# Altium schematic sheet Power supply.SchDoc
size A4
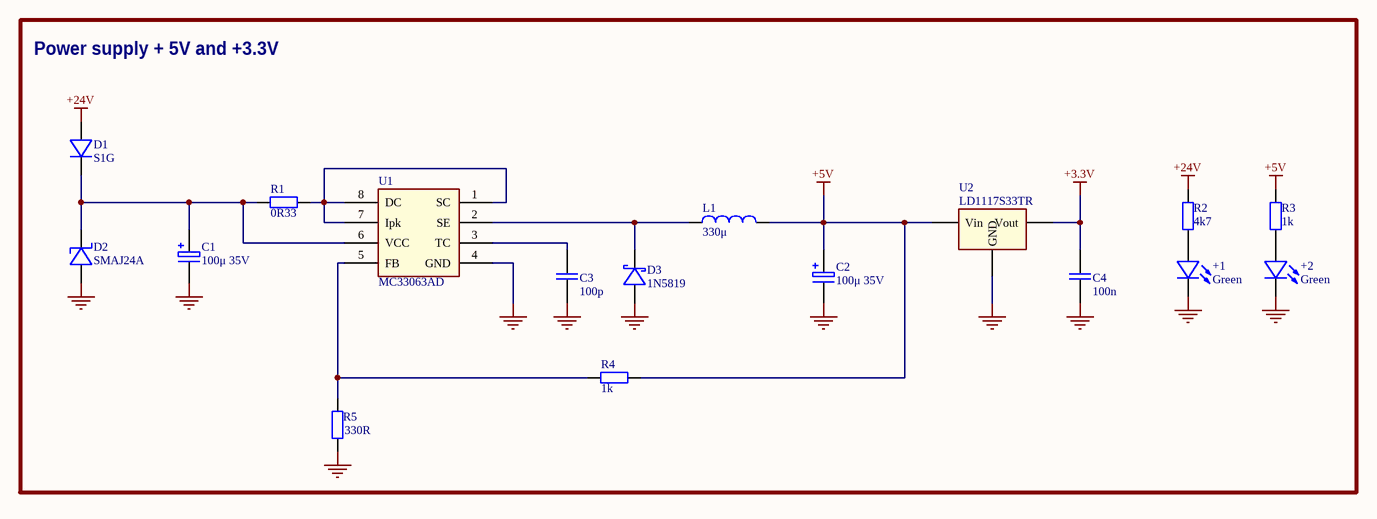
[diagram p0: Power supply.SchDoc]

## Parts
+1  Green  [D LED green 0805]
+2  Green  [D LED green 0805]
C1  100μ 35V  [Cap Pol Size D]
C2  100μ 35V  [Cap Pol Size D]
C3  100p  [Cap 0805]
C4  100n  [Cap 0805]
D1  S1G  [DO-214AC (SMA)]
D2  SMAJ24A  [DO-214AC (SMA)]
D3  1N5819  [SOD-123]
L1  330μ  [SRR1050A]
R1  0R33  [Res 0805]
R2  4k7  [Res 0805]
R3  1k  [Res 0805]
R4  1k  [Res 0805]
R5  330R  [Res 0805]
U1  MC33063AD  [SOIC-8]
U2  LD1117S33TR  [SOT-223 (Tab=Pin 2)]

## Blocks framed on the sheet
Power supply + 5V and +3.3V: +1 +2 C1-C4 D1-D3 L1 R1-R5 U1 U2

## Nets
+3.3V: C4.1 U2.2(Vout)
+5V: C2.1 L1.2 R3.2 R4.2 U2.3(Vin)
+24V: D1.2 R2.2
GND: +1.1 +2.1 C1.2 C2.2 C3.2 C4.2 D2.2 D3.A R5.1 U1.4(GND) U2.1(GND)
Net+1_2: +1.2 R2.1
Net+2_2: +2.2 R3.1
NetC1_1: C1.1 D1.1 D2.1 R1.1 U1.6(VCC)
NetC3_1: C3.1 U1.3(TC)
NetD3_K: D3.K L1.1 U1.2(SE)
NetR1_2: R1.2 U1.1(SC) U1.7(Ipk) U1.8(DC)
NetR4_1: R4.1 R5.2 U1.5(FB)

## Library data of the parts
+1 +2 = D LED green: LED green SMD 0805
C1 C2 = Cap Al El 100uF 35V SMD size D: Electrolytic Capacitor 100uF 35V SMD size D
C3 = Cap 100pF 50V 0805 SMD: Capacitor 100pF 50V 0805 SMD
C4 = Cap 100nF 50V 0805 SMD: Capacitor 100nF 50V 0805 SMD
D1 = D S1G: Diode SMD DO-214AC (SMA)
D2 = D SMAJ24A: Diode SMD DO-214AC (SMA)
D3 = D 1N5819: Diode SMD SOD-123
L1 = Inductor 330uH VLP8040T-331M SMD
R1 = Res 0R33 0805 SMD: Resistor 0R33 0805 SMD
R2 = Res 4k7 0805 SMD: Resistor 4k7 0805 SMD
R3 R4 = Res 1k 0805 SMD: Resistor 1k 0805 SMD
R5 = Res 330k 1% 0805 SMD: Resistor 330k 1% 0805 SMD
U1 = MC33063AD: Switching regulator, SOIC 8-pin, -40°C to +85°C
U2 = LD1117S33TR: Voltage regulator, 3.3 V, 800 mA, SOT-223